# Altium schematic sheet POW.SchDoc
size A4; DocumentNumber: 2; SheetNumber: 2; SheetTotal: 4
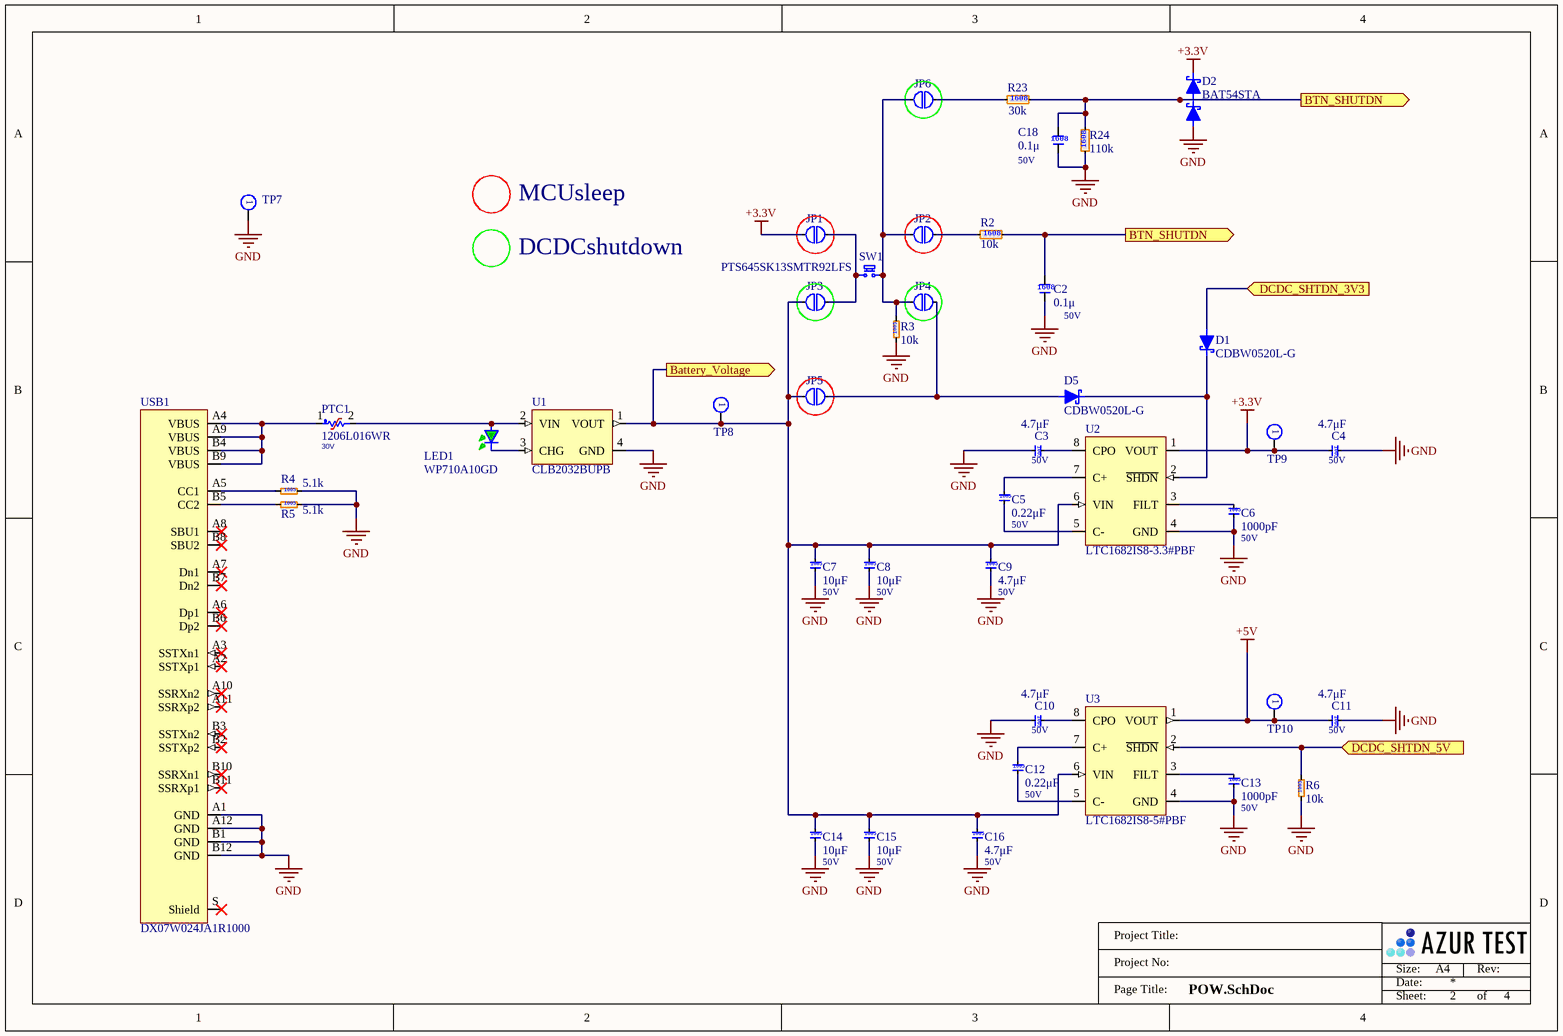
[diagram p0: POW.SchDoc]

## Parts
C2  Tag: 0.1μ  Voltage: 50V  [C1608]  (hidden comment: GRM1885C1H101JA01D)
C3  Tag: 4.7μF  Voltage: 50V  [C1005]  (hidden comment: GRM155B11H472K)
C4  Tag: 4.7μF  Voltage: 50V  [C1005]  (hidden comment: GRM155B11H472K)
C5  Tag: 0.22μF  Voltage: 50V  [C1005]  (hidden comment: GRM1552C1H221J)
C6  Tag: 1000pF  Voltage: 50V  [C1005]  (hidden comment: GRM1552C1H102J)
C7  Tag: 10μF  Voltage: 50V  [C1005]  (hidden comment: GRM155F11H103Z)
C8  Tag: 10μF  Voltage: 50V  [C1005]  (hidden comment: GRM155F11H103Z)
C9  Tag: 4.7μF  Voltage: 50V  [C1005]  (hidden comment: GRM155B11H472K)
C10  Tag: 4.7μF  Voltage: 50V  [C1005]  (hidden comment: GRM155B11H472K)
C11  Tag: 4.7μF  Voltage: 50V  [C1005]  (hidden comment: GRM155B11H472K)
C12  Tag: 0.22μF  Voltage: 50V  [C1005]  (hidden comment: GRM1552C1H221J)
C13  Tag: 1000pF  Voltage: 50V  [C1005]  (hidden comment: GRM1552C1H102J)
C14  Tag: 10μF  Voltage: 50V  [C1005]  (hidden comment: GRM155F11H103Z)
C15  Tag: 10μF  Voltage: 50V  [C1005]  (hidden comment: GRM155F11H103Z)
C16  Tag: 4.7μF  Voltage: 50V  [C1005]  (hidden comment: GRM155B11H472K)
C18  Tag: 0.1μ  Voltage: 50V  [C1608]  (hidden comment: GRM1885C1H101JA01D)
D1  CDBW0520L-G  [SOD-123]
D2  BAT54STA  [SOT-23]
D5  CDBW0520L-G  [SOD-123]
JP1  SMD_JAMPER  [SMD_JAMPER]  (value not drawn)  (no BOM)
JP2  SMD_JAMPER  [SMD_JAMPER]  (value not drawn)  (no BOM)
JP3  SMD_JAMPER  [SMD_JAMPER]  (value not drawn)  (no BOM)
JP4  SMD_JAMPER  [SMD_JAMPER]  (value not drawn)  (no BOM)
JP5  SMD_JAMPER  [SMD_JAMPER]  (value not drawn)  (no BOM)
JP6  SMD_JAMPER  [SMD_JAMPER]  (value not drawn)  (no BOM)
LED1  WP710A10GD  [LED_T1]
PTC1  1206L016WR  Voltage: 30V  [1206L]
R2  Tag: 10k  [R1608]  (hidden comment: RG1608P-103-B-T5)
R3  Tag: 10k  [R1005]  (hidden comment: RG1005P-103-B-T5)
R4  Tag: 5.1k  [R1005]  (hidden comment: RG1005P-512-B-T5)
R5  Tag: 5.1k  [R1005]  (hidden comment: RG1005P-512-B-T5)
R6  Tag: 10k  [R1005]  (hidden comment: RG1005P-103-B-T5)
R23  Tag: 30k  [R1608]  (hidden comment: RG1608P-303-B-T5)
R24  Tag: 110k  [R1608]  (hidden comment: RG1608P-114-B-T5)
SW1  PTS645SK13SMTR92LFS  [PTS645SK13SMTR92LFS]
TP7  TP1mm  [TP1mm]  (value not drawn)  (no BOM)
TP8  TP1mm  [TP1mm]  (value not drawn)  (no BOM)
TP9  TP1mm  [TP1mm]  (value not drawn)  (no BOM)
TP10  TP1mm  [TP1mm]  (value not drawn)  (no BOM)
U1  CLB2032BUPB  [CLB2032BUPB]
U2  LTC1682IS8-3.3#PBF  [SOIC8_3.9mm]
U3  LTC1682IS8-5#PBF  [SOIC8_3.9mm]
USB1  DX07W024JA1R1000  [DX07W024JA1R1000]

## Ports
Battery_Voltage (out), BTN_SHUTDN (out), DCDC_SHTDN_3V3 (in), DCDC_SHTDN_5V (in)

## Nets
+3.3V: C4.1 D2.2(K) JP1.1 TP9.1 U2.1(VOUT)
+5V: C11.1 TP10.1 U3.1(VOUT)
GND: C2.1 C3.1 C4.2 C6.1 C7.1 C8.1 C9.1 C10.1 C11.2 C13.1 C14.1 C15.1 C16.1 C18.1 D2.1(A) R3.1 R4.2 R5.2 R6.1 R24.1 TP7.1 U1.4(GND) U2.4(GND) U3.4(GND) USB1.A1(GND) USB1.A12(GND) USB1.B1(GND) USB1.B12(GND)
Battery_Voltage: C7.2 C8.2 C9.2 C14.2 C15.2 C16.2 JP3.1 JP5.1 TP8.1 U1.1(VOUT) U2.6(VIN) U3.6(VIN) ; port Battery_Voltage
BTN_SHUTDN: C2.2 C18.2 D2.3(C) R2.2 R23.2 R24.2 ; port BTN_SHUTDN
DCDC_SHTDN_3V3: D1.A ; port DCDC_SHTDN_3V3
DCDC_SHTDN_5V: R6.2 U3.2(~{SHDN}) ; port DCDC_SHTDN_5V
NetC3_2: C3.2 U2.8(CPO)
NetC5_1: C5.1 U2.5(C-)
NetC5_2: C5.2 U2.7(C+)
NetC6_2: C6.2 U2.3(FILT)
NetC10_2: C10.2 U3.8(CPO)
NetC12_1: C12.1 U3.5(C-)
NetC12_2: C12.2 U3.7(C+)
NetC13_2: C13.2 U3.3(FILT)
NetD1_K: D1.K D5.K U2.2(~{SHDN})
NetD5_A: D5.A JP4.2 JP5.2
NetJP1_2: JP1.2 JP3.2 SW1.1 SW1.2
NetJP2_1: JP2.1 JP4.1 JP6.1 R3.2 SW1.3 SW1.4
NetJP2_2: JP2.2 R2.1
NetJP6_2: JP6.2 R23.1
NetLED1_A: LED1.A PTC1.2 U1.2(VIN)
NetLED1_K: LED1.K U1.3(CHG)
NetPTC1_1: PTC1.1 USB1.A4(VBUS) USB1.A9(VBUS) USB1.B4(VBUS) USB1.B9(VBUS)
NetR4_1: R4.1 USB1.A5(CC1)
NetR5_1: R5.1 USB1.B5(CC2)

Not connected (* = marked no-connect by the designer): USB1 A2(SSTXp1)* A3(SSTXn1)* A6(Dp1)* A7(Dn1)* A8(SBU1)* A10(SSRXn2)* A11(SSRXp2)* B2(SSTXp2)* B3(SSTXn2)* B6(Dp2)* B7(Dn2)* B8(SBU2)* B10(SSRXn1)* B11(SSRXp1)* S(Shield)*

## Notes on the sheet
- MCUsleep
- DCDCshutdown
- Project Title:
- Project No:
- Size:
- Date:
- A4
- Rev:
- Page Title:
- Sheet:
- of
- (in symbol C1005) 1005
- (in symbol C1608) 1608
- (in symbol MF1005) 1005
- (in symbol MF1608) 1608

## Library data of the parts
C2 C18 = C1608: セラコン1608サイズ; Vendor: murata
C3-C16 = C1005: セラコン1005サイズ; Vendor: murata
D1 D5 = CDBW0520L-G: Schottky Rectifier; Vendor: Comchip Technology; Voltage: 20V; Current: 500mA
D2 = BAT54S: ダブル直列ショットキー; Vendor: Fairchild
LED1 = WP710A10GD: LED T1 GREEN; Vendor: Kingbright; Color: Green
PTC1 = 1206L: Resettable PTC; Vendor: Littelfuse; Trip_Current: *; Hold_Current: *
R2 R23 R24 = MF1608: 薄膜チップ抵抗1608サイズ; Vendor: susumu
R3-R6 = MF1005: 薄膜チップ抵抗1005サイズ; Vendor: susumu
SW1 = PTS645SK13SMTR92LFS: Tactile Switch 6 x 6mm; Vendor: C&K
TP7-TP10 = TP1mm: Test-Point 1mm
U1 = CLB2032BUPB: CLB電池ユニット　ピンタイプ
U2 = LTC1682IS8-3.3#PBF: IC REG CHARGE PUMP 3.3V 8SOIC
U3 = LTC1682IS8-5#PBF: IC REG CHARGE PUMP 5V MSOP8
USB1 = DX07W024JA1R1000: USB3.1 Type-C; Vendor: JAE